# Altium schematic sheet Vsense 0-69.3V.SchDoc: Vsense from 0 to 69.3V
size Letter; Date: 2017-02-08; DocumentNumber: 12; Revision: A; SheetNumber: 12; SheetTotal: 16; DesignedBy: Mike MacKay
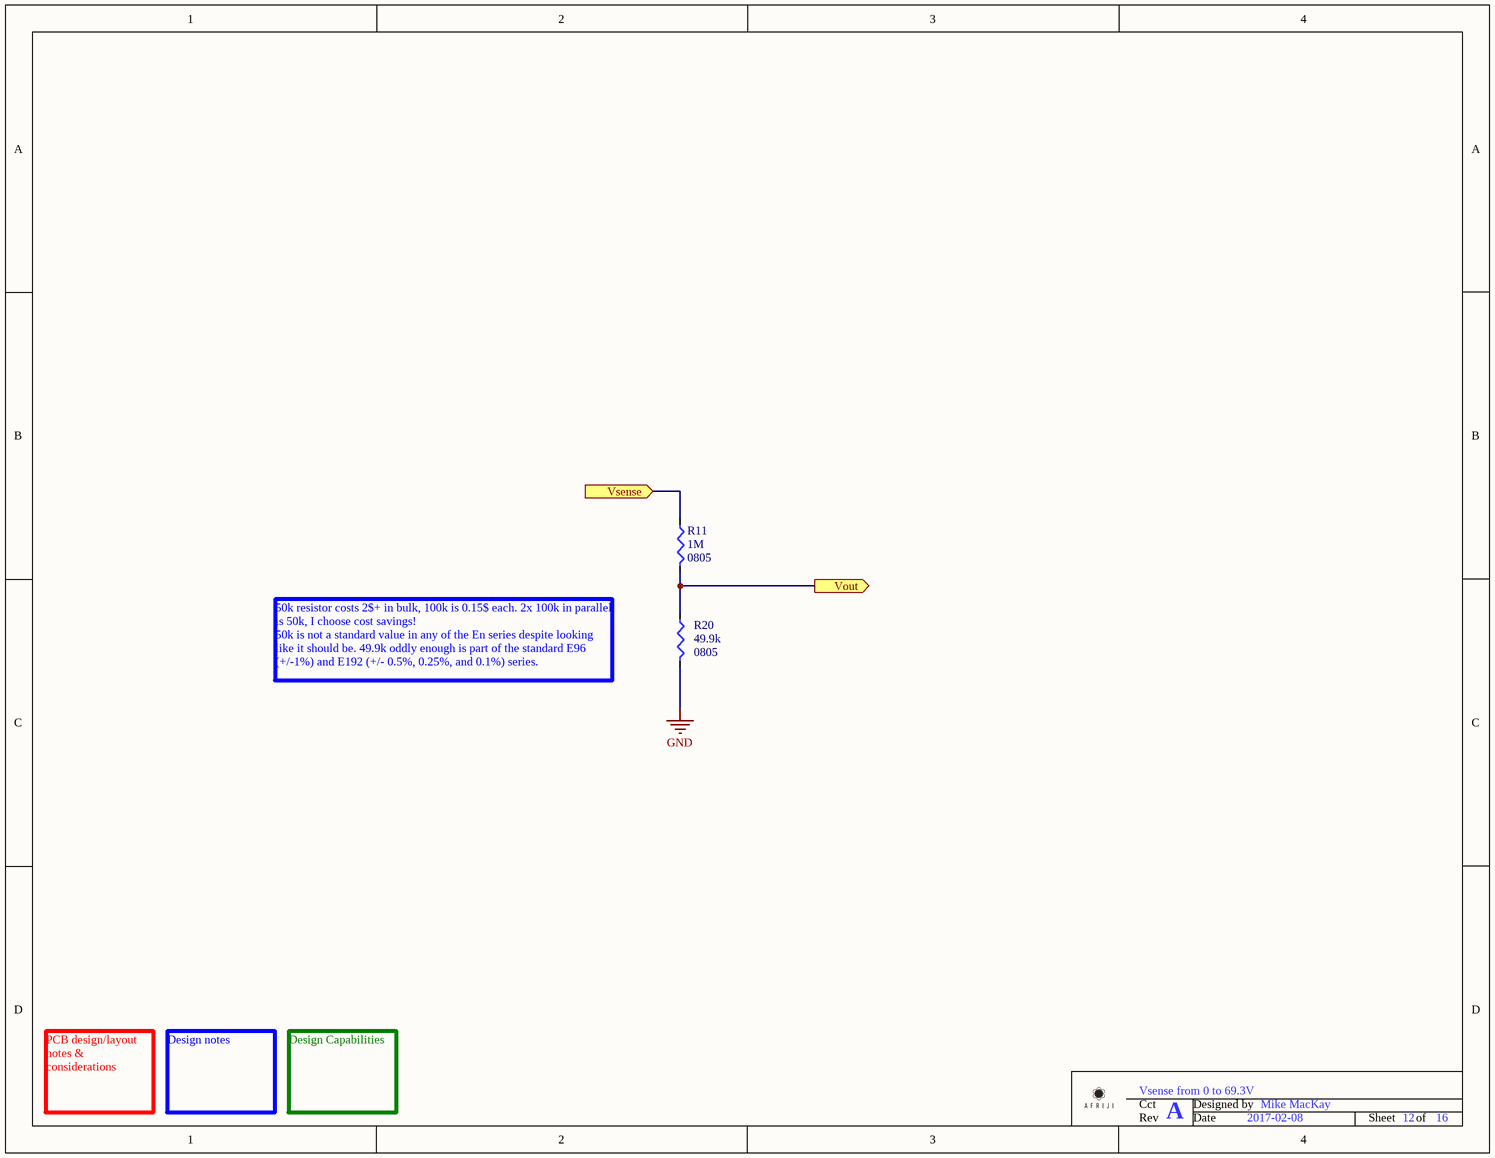
[diagram p0: Vsense 0-69.3V.SchDoc]

## Parts
R11  Resistance (Ohms): 1M  Package / Case: 0805  [R0805]  (hidden comment: Template - Resistor)
R20  Resistance (Ohms): 49.9k  Supplier Device Package: 0805  [R0805]  (hidden comment: Template - Resistor)

## Ports
Vout (out), Vsense (in)

## Nets
GND: R20.1
Vout: R11.1 R20.2 ; port Vout
Vsense: R11.2 ; port Vsense

## Notes on the sheet
- 50k resistor costs 2$+ in bulk, 100k is 0.15$ each. 2x 100k in parallel is 50k, I choose cost savings!
  50k is not a standard value in any of the En series despite looking like it should be. 49.9k oddly enough is part of the standard E96 (+/-1%) and E192 (+/- 0.5%, 0.25%, and 0.1%) series.
- PCB design/layout notes & considerations
- Design notes
- Design Capabilities
- Cct
- Designed by
- Rev
- Date
- Sheet
- of

## Library data of the parts
R11 = Template - Resistor: Resistor; Manufacturer: Yageo; Manufacturer Part Number: RC0805FR-071ML; Value: 1M 0805 1%; Tolerance: ±1%; Power (Watts): 0.125W, 1/8W; Temperature Coefficient: ±100ppm/°C; Technology: SMT; Supplier 1: Digi-Key; Supplier Part Number 1: 311-1.00MCRCT-ND; RoHS: RoHS Compliant; Category: Resistors; Stock 1: 1722700; Pricing 1: 1=0.1, 10=0.019, 25=0.0136, 50=0.0104, 100=0.0077, 250=0.00584, 500=0.00468, 1000=0.00345 (USD); Packaging: Cut Tape (CT); Part Status: Active; Composition: Thick Film; Features: Moisture Resistant; Operating Temperature: -55°C ~ 155°C; Supplier Device Package: 0805; Size / Dimension: 0.079" L x 0.049" W (2.00mm x 1.25mm); Height - Seated (Max): 0.024" (0.60mm); Number of Terminations: 2; Failure Rate: -; ComponentLink1URL: http://www.yageo.com/NewPortal/yageodocoutput?fileName=/pdf/R-Chip/PYu-RC_Group_51_RoHS_L_4.pdf; ComponentLink1Description: Spec Sheet
R20 = Template - Resistor: Manufacturer: Yageo; Manufacturer Part Number: RC0805FR-0749K9L; Value: 49.9k 0603 1%; Tolerance: ±1%; Power (Watts): 0.125W, 1/8W; Temperature Coefficient: ±100ppm/°C; Supplier 1: Digi-Key; Supplier Part Number 1: 311-49.9KCRCT-ND; RoHS: RoHS Compliant; Category: Resistors; Stock 1: 860512; Pricing 1: 1=0.1, 10=0.019, 25=0.0136, 50=0.0104, 100=0.0077, 250=0.00584, 500=0.00468, 1000=0.00345 (USD); Packaging: Cut Tape (CT); Part Status: Active; Composition: Thick Film; Features: Moisture Resistant; Operating Temperature: -55°C ~ 155°C; Package / Case: 0805 (2012 Metric); Size / Dimension: 0.079" L x 0.049" W (2.00mm x 1.25mm); Height - Seated (Max): 0.024" (0.60mm); Number of Terminations: 2; Failure Rate: -; ComponentLink1URL: http://www.yageo.com/NewPortal/yageodocoutput?fileName=/pdf/R-Chip/PYu-RC_Group_51_RoHS_L_4.pdf; ComponentLink1Description: http://www.yageo.com/NewPortal/yageodocoutput?fileName=/pdf/R-Chip/PYu-RC_Group_51_RoHS_L_4.pdf